# Altium schematic sheet 1-Holberton_Child_Top.SchDoc
size 420 x 297 mm; DocumentNumber: 1; SheetNumber: 10; SheetTotal: 14; PageSetup: Record=PageOptions|CenterHorizontal=True|CenterVertical=True|PrintScale=0.96|XCorrection=1.00|YCorrection=1.00|PrintKind=1|BorderSize=5000000|LeftOffset=0|BottomOffset=0|Orientation=2|PaperLength=4318|PaperWidth=2794|Scale=100|PaperSource=7|PrintQuality=600|MediaType=1|DitherType=10|PaperKind=11" x 17"|PrintScaleMode=1
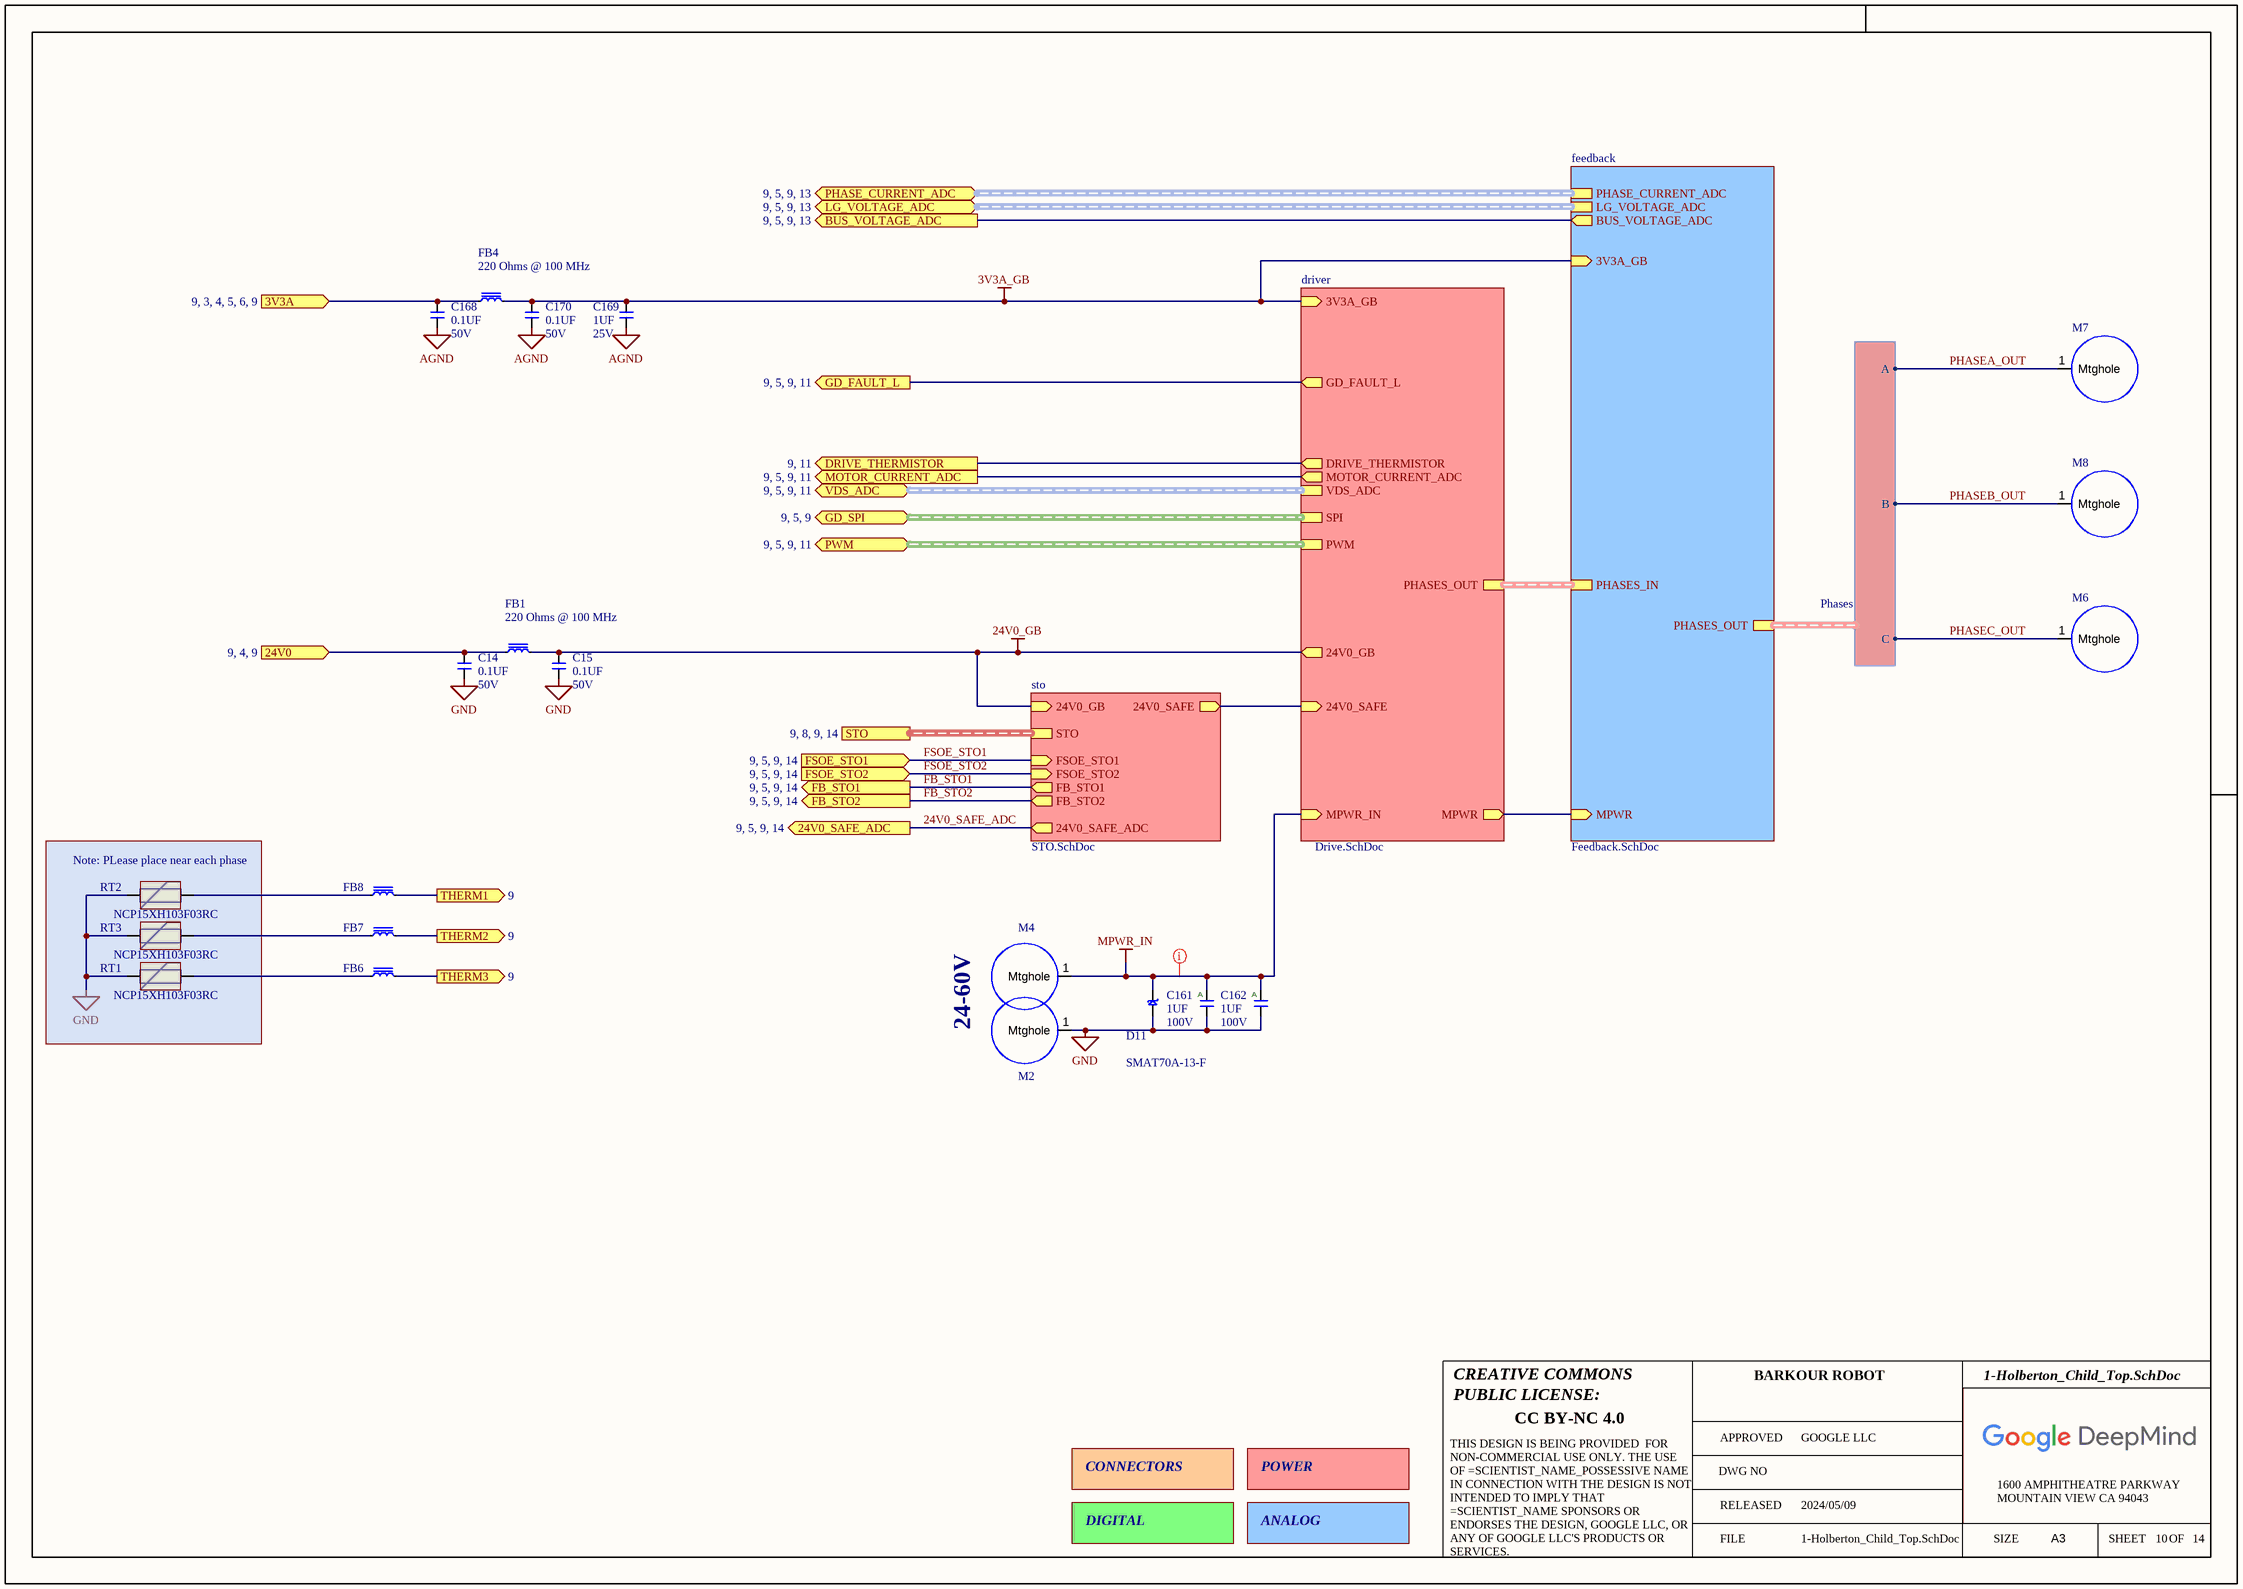
[diagram p0: 1-Holberton_Child_Top.SchDoc]

## Parts
C14  value 0.1UF  Voltage: 50V  [C0402]  (hidden comment: __Template_Cap)
C15  value 0.1UF  Voltage: 50V  [C0402]  (hidden comment: __Template_Cap)
C161  value 1UF  Voltage: 100V  [C0805]  (hidden comment: __Template_Cap_Auto)
C162  value 1UF  Voltage: 100V  [C0805]  (hidden comment: __Template_Cap_Auto)
C168  value 0.1UF  Voltage: 50V  [C0402]  (hidden comment: __Template_Cap)
C169  value 1UF  Voltage: 25V  [C0402]  (hidden comment: __Template_Cap)
C170  value 0.1UF  Voltage: 50V  [C0402]  (hidden comment: __Template_Cap)
D11  value SMAT70A-13-F  [SMA_B130-13-F]  (hidden comment: __Template_Diode_TVS_A/K)
FB1  value 220 Ohms @ 100 MHz  [INDC160X80X105L30N]  (hidden comment: LAIRD MI0603L221R-10)
FB4  value 220 Ohms @ 100 MHz  [INDC160X80X105L30N]  (hidden comment: LAIRD MI0603L221R-10)
FB6  LAIRD MI0603L221R-10  [INDC160X80X105L30N]  (value not drawn)
FB7  LAIRD MI0603L221R-10  [INDC160X80X105L30N]  (value not drawn)
FB8  LAIRD MI0603L221R-10  [INDC160X80X105L30N]  (value not drawn)
M2  1.7mm hole 5mm pad  [1.7hole5padRD]  (value not drawn)  (no BOM)
M4  1.7mm hole 5mm pad  [1.7hole5padRD]  (value not drawn)  (no BOM)
M6  Keystone_8737  [Keystone_8737]  (value not drawn)
M7  Keystone_8737  [Keystone_8737]  (value not drawn)
M8  Keystone_8737  [Keystone_8737]  (value not drawn)
RT1  Mfg P/N: NCP15XH103F03RC  [R0402]  (hidden comment: __Template_Thermistor)
RT2  Mfg P/N: NCP15XH103F03RC  [R0402]  (hidden comment: __Template_Thermistor)
RT3  Mfg P/N: NCP15XH103F03RC  [R0402]  (hidden comment: __Template_Thermistor)

## Blocks framed on the sheet
Note: PLease place near each phase: RT1-RT3

## Sub-sheets
driver = Drive.SchDoc: PWM (harness PWM), SPI (harness SPI), 24V0_GB (out), 24V0_SAFE (in), MPWR_IN (in), MOTOR_CURRENT_ADC (out), VDS_ADC (harness Phases), PHASES_OUT (harness Phases), 3V3A_GB (in), GD_FAULT_L (out), DRIVE_THERMISTOR (out), MPWR (out)
feedback = Feedback.SchDoc: PHASE_CURRENT_ADC (harness Phases), PHASES_OUT (harness Phases), PHASES_IN (harness Phases), LG_VOLTAGE_ADC (harness Phases), BUS_VOLTAGE_ADC (out), 3V3A_GB (in), MPWR (in)
sto = STO.SchDoc: FB_STO2 (out), FSOE_STO1 (in), FSOE_STO2 (in), FB_STO1 (out), 24V0_SAFE (out), 24V0_SAFE_ADC (out), 24V0_GB (in), STO (harness STO)

## Ports
3V3A (in, see 9, 3, 4, 5, 6, 9), 24V0 (in, see 9, 4, 9), 24V0_SAFE_ADC (out, see 9, 5, 9, 14), BUS_VOLTAGE_ADC (out, see 9, 5, 9, 13), DRIVE_THERMISTOR (out, see 9, 11), FB_STO1 (out, see 9, 5, 9, 14), FB_STO2 (out, see 9, 5, 9, 14), FSOE_STO1 (in, see 9, 5, 9, 14), FSOE_STO2 (in, see 9, 5, 9, 14), GD_FAULT_L (out, see 9, 5, 9, 11), GD_SPI (bidir, see 9, 5, 9), LG_VOLTAGE_ADC (bidir, see 9, 5, 9, 13), MOTOR_CURRENT_ADC (out, see 9, 5, 9, 11), PHASE_CURRENT_ADC (bidir, see 9, 5, 9, 13), PWM (bidir, see 9, 5, 9, 11), STO (harness STO, see 9, 8, 9, 14), THERM1 (out, see 9), THERM2 (out, see 9), THERM3 (out, see 9), VDS_ADC (bidir, see 9, 5, 9, 11)

## Harnesses
Phases: A, B, C

## Nets
3V3A_GB: C169.1 C170.1 FB4.2 ; sheet feedback/3V3A_GB, sheet driver/3V3A_GB
24V0_GB: C15.1 FB1.2 ; sheet driver/24V0_GB, sheet sto/24V0_GB
AGND: C168.2 C169.2 C170.2
GND: C14.2 C15.2 C161.2 C162.2 D11.A M2.1(Mtghole) RT1.2 RT2.2 RT3.2
MPWR_IN: C161.1 C162.1 D11.K M4.1(Mtghole) ; sheet driver/MPWR_IN
3V3A: C168.1 FB4.1 ; port 3V3A
24V0: C14.1 FB1.1 ; port 24V0
24V0_SAFE_ADC: port 24V0_SAFE_ADC, sheet sto/24V0_SAFE_ADC
BUS_VOLTAGE_ADC: port BUS_VOLTAGE_ADC, sheet feedback/BUS_VOLTAGE_ADC
DRIVE_THERMISTOR: port DRIVE_THERMISTOR, sheet driver/DRIVE_THERMISTOR
FB_STO1: port FB_STO1, sheet sto/FB_STO1
FB_STO2: port FB_STO2, sheet sto/FB_STO2
FSOE_STO1: port FSOE_STO1, sheet sto/FSOE_STO1
FSOE_STO2: port FSOE_STO2, sheet sto/FSOE_STO2
GD_FAULT_L: port GD_FAULT_L, sheet driver/GD_FAULT_L
MOTOR_CURRENT_ADC: port MOTOR_CURRENT_ADC, sheet driver/MOTOR_CURRENT_ADC
PHASEA_OUT: M7.1(Mtghole) ; sheet feedback/PHASES_OUT.A
PHASEB_OUT: M8.1(Mtghole) ; sheet feedback/PHASES_OUT.B
PHASEC_OUT: M6.1(Mtghole) ; sheet feedback/PHASES_OUT.C
THERM1: FB8.2 ; port THERM1
THERM2: FB7.2 ; port THERM2
THERM3: FB6.2 ; port THERM3
NetFB6_1: FB6.1 RT1.1
NetFB7_1: FB7.1 RT3.1
NetFB8_1: FB8.1 RT2.1
(unnamed): sheet feedback/MPWR, sheet driver/MPWR
(unnamed): sheet driver/24V0_SAFE, sheet sto/24V0_SAFE

## Buses and harness runs
harness port GD_SPI = sheet driver/SPI
harness port LG_VOLTAGE_ADC = sheet feedback/LG_VOLTAGE_ADC
harness port PHASE_CURRENT_ADC = sheet feedback/PHASE_CURRENT_ADC
harness port PWM = sheet driver/PWM
harness port STO = sheet sto/STO
harness port VDS_ADC = sheet driver/VDS_ADC
harness sheet driver/PHASES_OUT = sheet feedback/PHASES_IN

## Layout directives
net class HV: MPWR_IN

## Notes on the sheet
- 24-60V
- CONNECTORS
- POWER
- DIGITAL
- ANALOG
- CREATIVE COMMONS
- PUBLIC LICENSE:
- BARKOUR ROBOT
- CC BY-NC 4.0
- APPROVED
- DWG NO
- GOOGLE LLC
- FILE
- RELEASED
- 2024/05/09
- SIZE
- 1600 AMPHITHEATRE PARKWAY
- MOUNTAIN VIEW CA 94043
- A3
- SHEET
- OF
- THIS DESIGN IS BEING PROVIDED  FOR NON-COMMERCIAL USE ONLY. THE USE OF =SCIENTIST_NAME_POSSESSIVE NAME IN CONNECTION WITH THE DESIGN IS NOT INTENDED TO IMPLY THAT =SCIENTIST_NAME SPONSORS OR ENDORSES THE DESIGN, GOOGLE LLC, OR ANY OF GOOGLE LLC'S PRODUCTS OR SERVICES.
- (in symbol 1093) A

## Library data of the parts
C14 C15 C168 C170 = 1762: CAP, CER, X5R, 0.1uF, 10%, 50V, 0402, 0.55mm; MFG: YAGEO; MFG P/N: CC0402KRX5R9BB104; Status: Released; Package: 0402; Supplier 1: Digi-Key; ComponentLink1URL: http://www.yageo.com/documents/recent/UPY-GPHC_X5R_4V-to-50V_25.pdf; Supplier Part Number 1: 311-3342-1-ND
C161 C162 = 1093: CAP, CER, X7S, 1uF, 20%, 100V, 0805; MFG: TDK; MFG P/N: CGA4J3X7S2A105M125AE; COMMON: 150-01093-00; Status: Released; Package: 0805; Supplier 1: Digi-Key; ComponentLink1URL: https://www.digikey.com/en/products/detail/tdk-corporation/CGA4J3X7S2A105M125AE/2782484; Supplier Part Number 1: 445-7961-1-ND
C169 = 1717: CAP, CER, X5R, 1uF, 10%, 25V, 0402; MFG: TDK; MFG P/N: C1005X5R1E105K050BC; COMMON: 150-01202-00; Status: Released; Package: 0402; Supplier 1: Digi-Key; ComponentLink1URL: https://product.tdk.com/info/en/catalog/datasheets/mlcc_commercial_general_en.pdf; Supplier Part Number 1: 445-9066-1-ND
D11 = 200: DIODE, TVS, UNI-DIR, 70VR, 100VCL, 400W, 140PF @1MHZ, SMA; MFG: Diodes Incorporated; Status: Released; MFG P/N: SMAT70A-13-F; Package: SMA; Supplier 1: Digi-Key; ComponentLink1URL: https://www.diodes.com/assets/Datasheets/ds30213.pdf; Supplier Part Number 1: SMAT70A-FDICT-ND
FB1 FB4 = f5bd4cf1-070f-4480-bf1a-f8cba0e78574: FERRITE BEAD 220 OHM 0603 1LN; MFG: Laird-Signal Integrity Products; Package: Inductor, 0603; ComponentLink1URL: https://media.digikey.com/pdf/Data%20Sheets/Laird%20Technologies/EMI_Filtering_and_RF_Inductors.pdf; Status: Preliminary; MFG P/N: MI0603L221R-10; Supplier 1: Digi-Key; Supplier Part Number 1: 240-2558-1-ND
FB6-FB8 = f5bd4cf1-070f-4480-bf1a-f8cba0e78574: FERRITE BEAD 220 OHM 0603 1LN; Value: 220 Ohms @ 100 MHz; MFG: Laird-Signal Integrity Products; Package: Inductor, 0603; ComponentLink1URL: https://media.digikey.com/pdf/Data%20Sheets/Laird%20Technologies/EMI_Filtering_and_RF_Inductors.pdf; Status: Preliminary; MFG P/N: MI0603L221R-10; Supplier 1: Digi-Key; Supplier Part Number 1: 240-2558-1-ND
M2 M4 = MtgHole_1
M6-M8 = MtgHole_1: Motor lead attachement points Keystone_8737; MFG: Keystone Electronics; MFG P/N: 8737; Value: 8737; Supplier 1: Digi-Key; Supplier Part Number 1: 36-8737-ND
RT1-RT3 = 175: SENSOR, THERMISTOR, NTC, 10K, 1%, 3380K, 100mW, 0402; Mfg: Murata Electronics; Value: 10KOHM; Status: Released; Package: 0402; Supplier 1: Digi-Key; ComponentLink1URL: https://www.murata.com/en-us/api/pdfdownloadapi?cate=&partno=NCP15XH103F03RC; Supplier Part Number 1: 490-4801-1-ND